# EAGLE design Explorer (EAGLE 9.6.2)
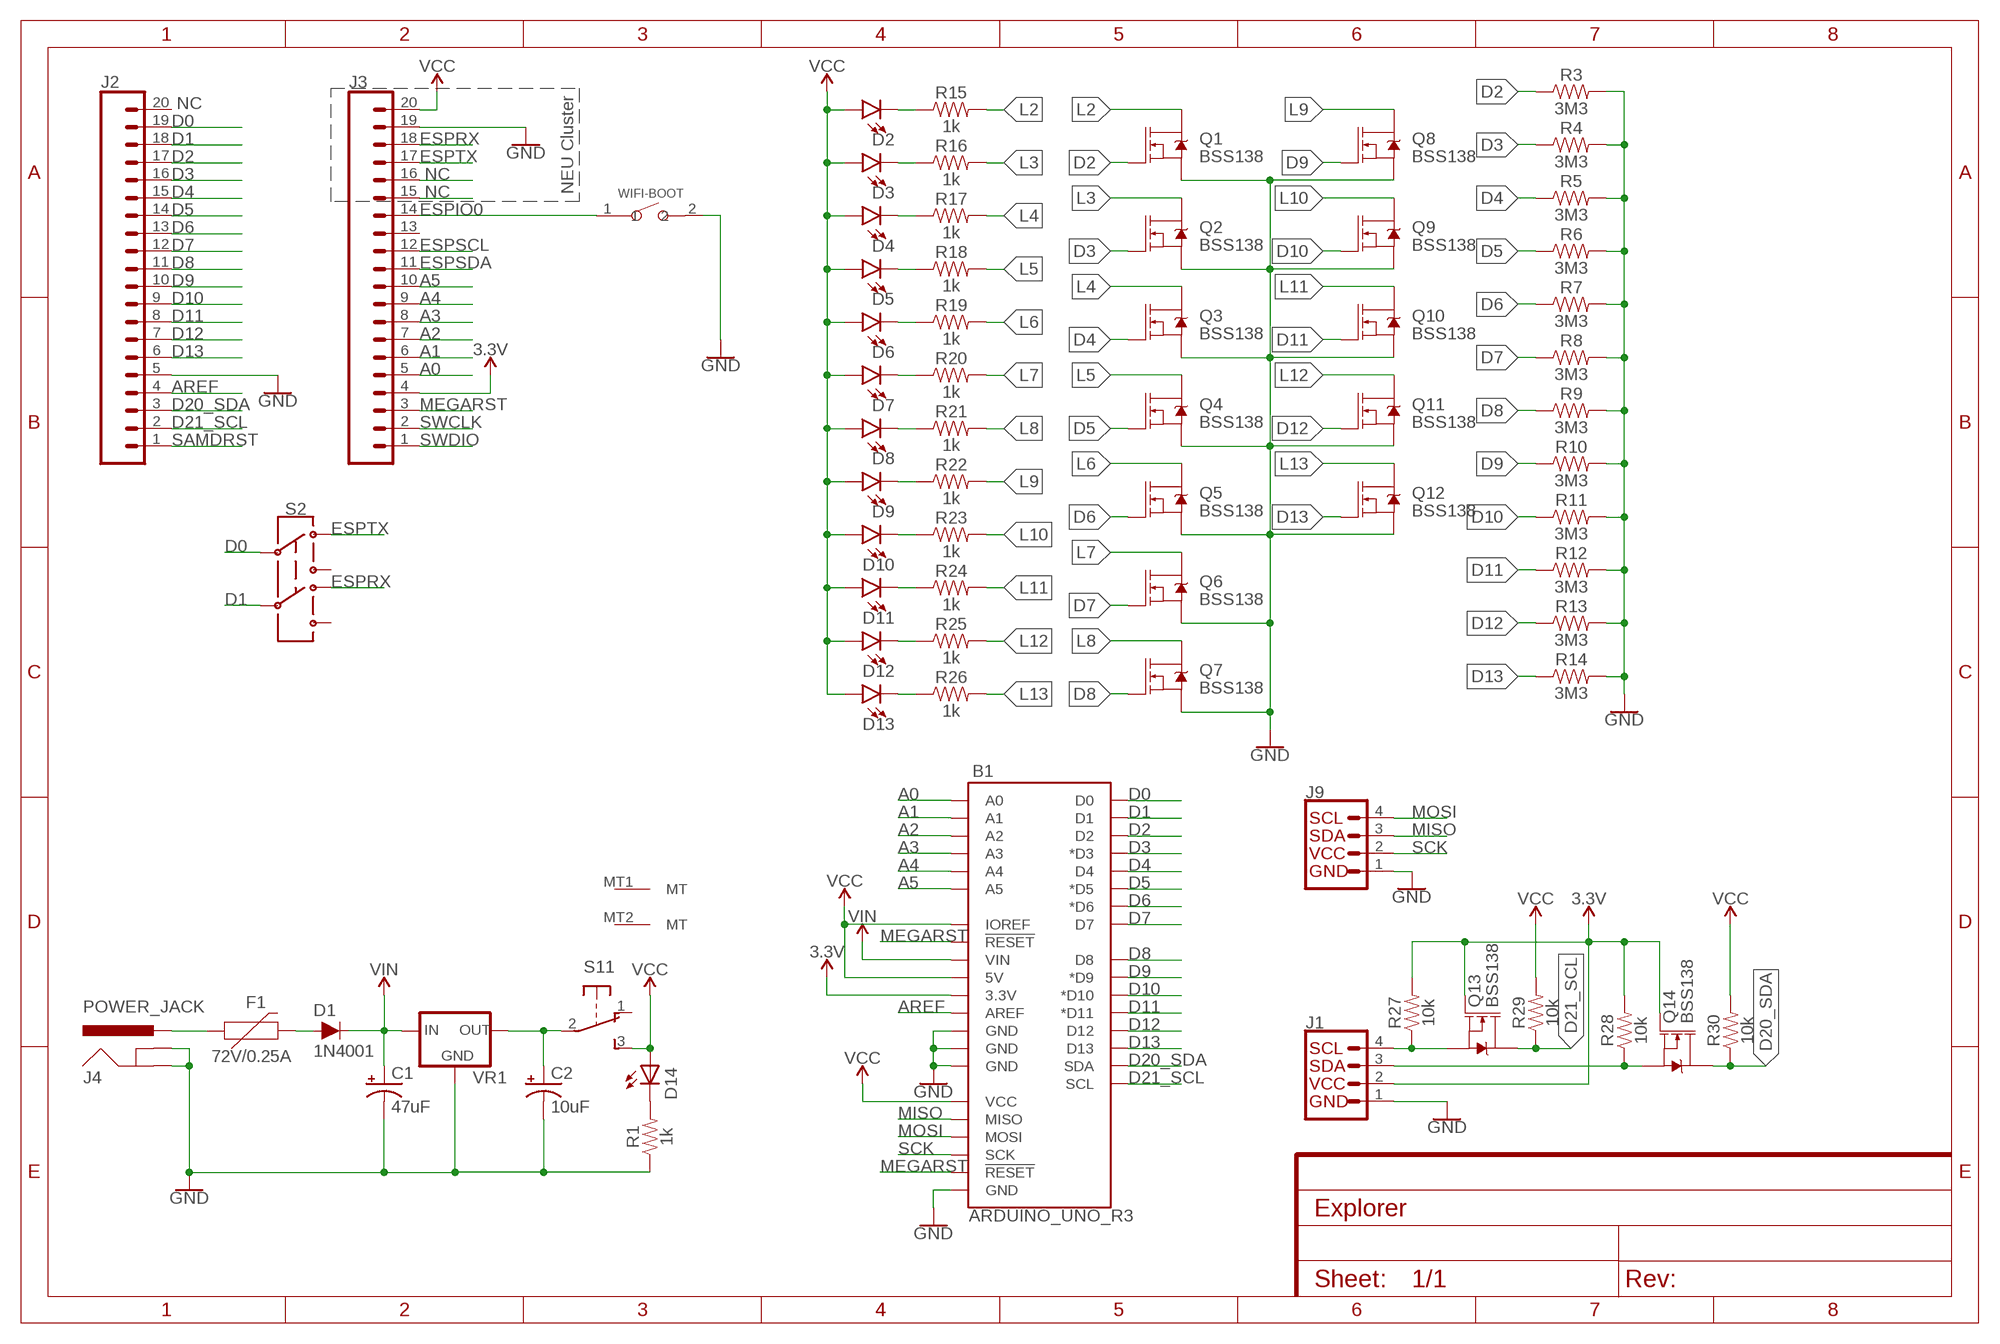
[diagram p0: schematic, sheet 1]

## Parts
B1  ARDUINO_UNO_R3  [ARDUINO_R3]
C1  47uF  100UF-POLAR-RADIAL-2.5MM-25V-20%  [CPOL-RADIAL-2.5MM-6.5MM]
C2  10uF  100UF-POLAR-RADIAL-2.5MM-25V-20%  [CPOL-RADIAL-2.5MM-6.5MM]
D1  1N4001  DIODE-KIT2  [DIODE-1N4001-KIT]
D2  LED0603  [LED-0603]
D3  LED0603  [LED-0603]
D4  LED0603  [LED-0603]
D5  LED0603  [LED-0603]
D6  LED0603  [LED-0603]
D7  LED0603  [LED-0603]
D8  LED0603  [LED-0603]
D9  LED0603  [LED-0603]
D10  LED0603  [LED-0603]
D11  LED0603  [LED-0603]
D12  LED0603  [LED-0603]
D13  LED0603  [LED-0603]
D14  LEDCHIPLED_0805  [CHIPLED_0805]
F1  72V/0.25A  PPTC_PTH  [PTH]
J1  QWIIC_CONNECTORJS-1MM  [1X04_1MM_RA]
J2  CONN_20  [1X20]
J3  CONN_20  [1X20]
J4  POWER_JACK  [POWER_JACK_PTH]
J9  QWIIC_CONNECTORJS-1MM  [1X04_1MM_RA]
Q1  BSS138  MOSFET-NCH-BSS138  [SOT23-3]
Q2  BSS138  MOSFET-NCH-BSS138  [SOT23-3]
Q3  BSS138  MOSFET-NCH-BSS138  [SOT23-3]
Q4  BSS138  MOSFET-NCH-BSS138  [SOT23-3]
Q5  BSS138  MOSFET-NCH-BSS138  [SOT23-3]
Q6  BSS138  MOSFET-NCH-BSS138  [SOT23-3]
Q7  BSS138  MOSFET-NCH-BSS138  [SOT23-3]
Q8  BSS138  MOSFET-NCH-BSS138  [SOT23-3]
Q9  BSS138  MOSFET-NCH-BSS138  [SOT23-3]
Q10  BSS138  MOSFET-NCH-BSS138  [SOT23-3]
Q11  BSS138  MOSFET-NCH-BSS138  [SOT23-3]
Q12  BSS138  MOSFET-NCH-BSS138  [SOT23-3]
Q13  BSS138  MOSFET-NCH-BSS138  [SOT23-3]
Q14  BSS138  MOSFET-NCH-BSS138  [SOT23-3]
R1  1k  RESISTOR0603  [0603]
R3  3M3  RESISTOR0603  [0603]
R4  3M3  RESISTOR0603  [0603]
R5  3M3  RESISTOR0603  [0603]
R6  3M3  RESISTOR0603  [0603]
R7  3M3  RESISTOR0603  [0603]
R8  3M3  RESISTOR0603  [0603]
R9  3M3  RESISTOR0603  [0603]
R10  3M3  RESISTOR0603  [0603]
R11  3M3  RESISTOR0603  [0603]
R12  3M3  RESISTOR0603  [0603]
R13  3M3  RESISTOR0603  [0603]
R14  3M3  RESISTOR0603  [0603]
R15  1k  10KOHM-0603-1/10W-1%  [0603]
R16  1k  10KOHM-0603-1/10W-1%  [0603]
R17  1k  10KOHM-0603-1/10W-1%  [0603]
R18  1k  10KOHM-0603-1/10W-1%  [0603]
R19  1k  10KOHM-0603-1/10W-1%  [0603]
R20  1k  10KOHM-0603-1/10W-1%  [0603]
R21  1k  10KOHM-0603-1/10W-1%  [0603]
R22  1k  10KOHM-0603-1/10W-1%  [0603]
R23  1k  10KOHM-0603-1/10W-1%  [0603]
R24  1k  10KOHM-0603-1/10W-1%  [0603]
R25  1k  10KOHM-0603-1/10W-1%  [0603]
R26  1k  10KOHM-0603-1/10W-1%  [0603]
R27  10k  10KOHM-0603-1/10W-1%  [0603]
R28  10k  10KOHM-0603-1/10W-1%  [0603]
R29  10k  10KOHM-0603-1/10W-1%  [0603]
R30  10k  10KOHM-0603-1/10W-1%  [0603]
S1  EG1213  [EG1213]
S2  SWITCH-DPDT-SMD-AYZ0202  [SWITCH_DPDT_SMD_AYZ0202]
VR1  V_REG_78XXSINK  [TO220-IGO]
WIFI-BOOT  SKRKAEE020  SMD-BUTTON(2P-3.9X2.9X1.5+0.4MM)-SKRKAEE020  [SW2-2.6-3.9X2.9X1.5+0.4MM]

## Nets
3.3V: B1.3.3V J1.2(VCC) J3.4 Q13.1(G) Q14.1(G) R27.2 R28.2
A0: B1.A0 J3.5
A1: B1.A1 J3.6
A2: B1.A2 J3.7
A3: B1.A3 J3.8
A4: B1.A4 J3.9
A5: B1.A5 J3.10
AREF: B1.AREF J2.4
D0: B1.D0 J2.19 S2.2
D1: B1.D1 J2.18 S2.5
D2: B1.D2 J2.17 Q1.1(G) R3.1
D3: B1.D3(*D3) J2.16 Q2.1(G) R4.1
D4: B1.D4 J2.15 Q3.1(G) R5.1
D5: B1.D5(*D5) J2.14 Q4.1(G) R6.1
D6: B1.D6(*D6) J2.13 Q5.1(G) R7.1
D7: B1.D7 J2.12 Q6.1(G) R8.1
D8: B1.D8 J2.11 Q7.1(G) R9.1
D9: B1.D9(*D9) J2.10 Q8.1(G) R10.1
D10: B1.D10(*D10) J2.9 Q9.1(G) R11.1
D11: B1.D11(*D11) J2.8 Q10.1(G) R12.1
D12: B1.D12 J2.7 Q11.1(G) R13.1
D13: B1.D13 J2.6 Q12.1(G) R14.1
D20_SDA: B1.SDA J2.3 Q14.3(D) R30.1
D21_SCL: B1.SCL J2.2 Q13.3(D) R29.1
ESPIO0: J3.14 WIFI-BOOT.1
ESPRX: J3.18 S2.4
ESPSCL: J3.12
ESPSDA: J3.11
ESPTX: J3.17 S2.1
GND: B1.GND@1(GND) B1.GND@2(GND) B1.GND@3(GND) B1.GND@4(GND) C1.2(-) C2.2(-) J1.1(GND) J2.5 J3.19 J4.GND J4.GNDBREAK J9.1(GND) Q1.2(S) Q2.2(S) Q3.2(S) Q4.2(S) Q5.2(S) Q6.2(S) Q7.2(S) Q8.2(S) Q9.2(S) Q10.2(S) Q11.2(S) Q12.2(S) R1.1 R3.2 R4.2 R5.2 R6.2 R7.2 R8.2 R9.2 R10.2 R11.2 R12.2 R13.2 R14.2 VR1.GND WIFI-BOOT.2
L2: Q1.3(D) R15.2
L3: Q2.3(D) R16.2
L4: Q3.3(D) R17.2
L5: Q4.3(D) R18.2
L6: Q5.3(D) R19.2
L7: Q6.3(D) R20.2
L8: Q7.3(D) R21.2
L9: Q8.3(D) R22.2
L10: Q9.3(D) R23.2
L11: Q10.3(D) R24.2
L12: Q11.3(D) R25.2
L13: Q12.3(D) R26.2
MEGARST: B1.RESET@1(!RESET!) B1.RESET@2(!RESET!) J3.3
MISO: B1.MISO J9.3(SDA)
MOSI: B1.MOSI J9.4(SCL)
N$1: F1.P$1 J4.PWR
N$2: D1.A F1.P$2
N$3: J3.16
N$5: J3.15
N$6: D14.C R1.2
N$7: C2.1(+) S1.2(1:P) VR1.OUT
N$10: D13.C R26.1
N$11: D12.C R25.1
N$12: D11.C R24.1
N$13: D10.C R23.1
N$14: D9.C R22.1
N$15: D8.C R21.1
N$16: D7.C R20.1
N$17: D6.C R19.1
N$18: D5.C R18.1
N$19: D4.C R17.1
N$20: D3.C R16.1
N$21: D2.C R15.1
SAMDRST: J2.1
SCK: B1.SCK J9.2(VCC)
SCL_3V: J1.4(SCL) Q13.2(S) R27.1
SDA_3V: J1.3(SDA) Q14.2(S) R28.1
SWCLK: J3.2
SWDIO: J3.1
VCC: B1.5V B1.IOREF B1.VCC D2.A D3.A D4.A D5.A D6.A D7.A D8.A D9.A D10.A D11.A D12.A D13.A D14.A J3.20 R29.2 R30.2 S1.3(1:S)
VIN: B1.VIN C1.1(+) D1.C VR1.IN
Unconnected: J2.20 J3.13 S1.1(1:O) S1.MT1(MT) S1.MT2(MT) S2.3 S2.6

## Notes on the sheet
- NC
- NEU Cluster
- NC
- NC

## Library data of the parts
B1 = SparkFun-Boards:ARDUINO_UNO_R3: Arduino R3 Footprint with SPI header Arduino Uno R3 Compatible Footprint. Matches PCB size of the original board. SparkFun Products: SAMD21 Dev Breakout <https://www.sparkfun.com/products/13672> RedBoard <https://www.sparkfun.com/products/12757> R3 Stackable Headers <https://www.sparkfun.com/products/11417>
C1 = SparkFun-Capacitors:100UF-POLAR: 100µF polarized capacitors A capacitor is a passive two-terminal electrical component used to store electrical energy temporarily in an electric field.; E14PID: 9452494; PROD_ID: CAP-08439; VALUE: 100uF
C2 = SparkFun-Capacitors:100UF-POLAR: 100µF polarized capacitors A capacitor is a passive two-terminal electrical component used to store electrical energy temporarily in an electric field.; E14PID: 1870986; PROD_ID: CAP-08439; VALUE: 100uF
D1 = SparkFun-DiscreteSemi:DIODE: Diode These are standard reverse protection diodes and small signal diodes. SparkFun Products: SparkFun SparkPunk Sound Kit <https://www.sparkfun.com/products/11177> SparkFun ESP8266 Thing <https://www.sparkfun.com/products/13231>; PROD_ID: DIO-09176; VALUE: 1A/50V/1.1V
D2-D13 = SparkFun-LED:LED: LED (Generic) Standard schematic elements and footprints for 5mm, 3mm, 1206, and 0603 sized LEDs. Generic LEDs with no color specified.; LCSC_PART: C2286
D14 = adafruit:LED: LED OSRAM: - CHIPLED LG R971, LG N971, LY N971, LG Q971, LY Q971, LO R971, LY R971 LH N974, LH R974 LS Q976, LO Q976, LY Q976 LO Q996 - Hyper CHIPLED LW Q18S LB Q993, LB Q99A, LB R99A - SideLED LS A670, LO A670, LY A670, LG A670, LP A670 LB A673, LV A673, LT A673, LW A673 LH A674 LY A675 LS A676, LA A676, LO A676, LY A676, LW A676 LS A679, LY A679, LG A679 - Hyper Micro SIDELED® LS Y876, LA Y876, LO Y876, LY Y876 LT Y87S - SmartLED LW L88C, LW L88S LB L89C, LB L89S, LG L890 LS L89K, LO L89K, LY L89K LS L896, LA L896, LO L896, LY L896 - TOPLED LS T670, LO T670, LY T670, LG T670, LP T670 LSG T670, LSP T670, LSY T670, LOP T670, LYG T670 LG T671, LOG T671, LSG T671 LB T673, LV T673, LT T673, LW T673 LH T674 LS T676, LA T676, LO T676, LY T676, LB T676, LH T676, LSB T676, LW T676 LB T67C, LV T67C, LT T67C, LS T67K, LO T67K, LY T67K, LW E67C LS E67B, LA E67B, LO E67B, LY E67B, LB E67C, LV E67C, LT E67C LW T67C LS T679, LY T679, LG T679 LS T770, LO T770, LY T770, LG T770, LP T770 LB T773, LV T773, LT T773, LW T773 LH T774 LS E675, LA E675, LY E675, LS T675 LS T776, LA T776, LO T776, LY T776, LB T776 LHGB T686 LT T68C, LB T68C - Hyper Mini TOPLED® LB M676 - Mini TOPLED Santana® LG M470 LS M47K, LO M47K, LY M47K Source: http://www.osram.convergy.de/; LCSC_PART: C2296
F1 = SparkFun-Fuses:PPTC: Resettable Fuse PPTC Resettable Fuse. Really a sort of resistor with a polymeric positive temperature coefficient whose resistance increases dramatically with an increase in temperature. When heated by the power passing through the resistance rises causing the current to be limited, protecting the circuit. This is achieved by the transition of the polymer from a crystalline to an amorphous state where the conductive carbon separates breaking the conductive pathways found in the cool crystalline structure. When a PPTC cools back down it resumes conducting letting the circuit turn back on. SparkFun Products: SparkFun RedBoard - Programmed with Arduino <https://www.sparkfun.com/products/12757> Pro Micro - 5V/16MHz <https://www.sparkfun.com/products/12640> Arduino Pro 328 - 5V/16MHz <https://www.sparkfun.com/products/10915> MP3 Trigger <https://www.sparkfun.com/products/13720>; PROD_ID: RES-08490
J1 = SparkFun-Connectors:QWIIC_CONNECTOR: SparkFun I2C Standard Qwiic Connector An SMD 1mm pitch JST connector makes it easy and quick (get it? Qwiic?) to connect I2C devices to each other. The Qwiic system <http://www.sparkfun.com/qwiic> enables fast and solderless connection between popular platforms and various sensors and actuators. We carry 200mm <https://www.sparkfun.com/products/14204>, 100mm <https://www.sparkfun.com/products/14205>, 50mm <https://www.sparkfun.com/products/14206>, and breadboard friendly <https://www.sparkfun.com/products/14207> Qwiic cables. We also offer 10 pcs strips <https://www.sparkfun.com/products/14323> the SMD connectors.; LCSC_PART: C239522; LCSC_PART_OLD: C145956
J2 J3 = SparkFun-Connectors:CONN_20: Multi connection point. Often used as Generic Header-pin footprint for 0.1 inch spaced/style header connections On any of the 0.1 inch spaced packages, you can populate with these: Break Away Headers - Straight <https://www.sparkfun.com/products/116> (PRT-00116) Break Away Male Headers - Right Angle <https://www.sparkfun.com/products/553> (PRT-00553) Female Headers <https://www.sparkfun.com/products/115> (PRT-00115) Break Away Headers - Machine Pin <https://www.sparkfun.com/products/117> (PRT-00117) Break Away Female Headers - Swiss Machine Pin <https://www.sparkfun.com/products/743> (PRT-00743) For SCREWTERMINALS and SPRING TERMINALS visit here: Screw Terimnals on SparkFun.com <https://www.sparkfun.com/search/results?term=Screw+Terminals> (5mm/3.5mm/2.54mm spacing) This device is also useful as a general connection point to wire up your design to another part of your project. Our various solder wires solder well into these plated through hole pads. Hook-Up Wire - Assortment (Stranded, 22 AWG) <https://www.sparkfun.com/products/11375> (PRT-11375) Hook-Up Wire - Assortment (Solid Core, 22 AWG) <https://www.sparkfun.com/products/11367> (PRT-11367) View the entire wire category on our website here <https://www.sparkfun.com/categories/141> Special notes: Molex polarized connector foot print use with SKU : PRT-08231 with associated crimp pins and housings. 1MM SMD Version SKU: PRT-10208 NOTES ON THE VARIANTS LOCK and LOCK_LONGPADS... This footprint was designed to help hold the alignment of a through-hole component (i.e. 6-pin header) while soldering it into place. You may notice that each hole has been shifted either up or down by 0.005 of an inch from it's more standard position (which is a perfectly straight line). This slight alteration caused the pins (the squares in the middle) to touch the edges of the holes. Because they are alternating, it causes a "brace" to hold the component in place. 0.005 has proven to be the perfect amount of "off-center" position when using our standard breakaway headers. Although looks a little odd when you look at the bare footprint, once you have a header in there, the alteration is very hard to notice. Also,if you push a header all the way into place, it is covered up entirely on the bottom side. Note about LOCK SPECIAL package: This is just like the LOCK variant in that the holes are staggared by 5 mil, but except for the last two holes. They are not altered from the "standard" footprint layout. This is used for a special purpose on the layout of our Graphic LCD Backpack. Make sure you want to use this device before selecting it for you project!; LCSC_PART: C50984
J4 = SparkFun-Connectors:POWER_JACK: Power Jack Connector This is the standard 5.5mm barrel jack for power. The PTH is the most common, proven, reliable, footprint. The Slot footprint only works if the mill layer is transmitted to the PCB fab house so be warned. Here are the connectors we sell at SparkFun: DC Barrel Power Jack/Connector <https://www.sparkfun.com/products/119> (PRT-00119) DC Barrel Power Jack/Connector (SMD) <https://www.sparkfun.com/products/12748> (PRT-12748) DC Barrel Jack Adapter - Breadboard Compatible <https://www.sparkfun.com/products/10811> (PRT-10811) It is used on this SparkFun product (and many, many others): SparkFun RedBoard - Programmed with Arduino <https://www.sparkfun.com/products/12757> (DEV-12757) Also, if you need a mating power supply or connector, please check these out: Wall Adapter Power Supply - 9VDC 650mA <https://www.sparkfun.com/products/298> (TOL-00298) DC Barrel Jack Adapter - Male <https://www.sparkfun.com/products/10287> (PRT-10287); PROD_ID: CONN-08197
J9 = SparkFun-Connectors:QWIIC_CONNECTOR: SparkFun I2C Standard Qwiic Connector An SMD 1mm pitch JST connector makes it easy and quick (get it? Qwiic?) to connect I2C devices to each other. The Qwiic system <http://www.sparkfun.com/qwiic> enables fast and solderless connection between popular platforms and various sensors and actuators. We carry 200mm <https://www.sparkfun.com/products/14204>, 100mm <https://www.sparkfun.com/products/14205>, 50mm <https://www.sparkfun.com/products/14206>, and breadboard friendly <https://www.sparkfun.com/products/14207> Qwiic cables. We also offer 10 pcs strips <https://www.sparkfun.com/products/14323> the SMD connectors.; LCSC_PART: C239522
Q1-Q14 = SparkFun-DiscreteSemi:MOSFET-NCH: N-channel MOSFETs Voltage controlled devices that allow control of high current outputs. SparkFun Products: SparkFun OpenScale <https://www.sparkfun.com/products/13261> SparkFun Digital Sandbox <https://www.sparkfun.com/products/12651> SparkFun Monster Moto Shield <https://www.sparkfun.com/products/10182> SparkFun MOSFET Power Controller <https://www.sparkfun.com/products/11214>; LCSC_PART: C435876; PROD_ID: TRANS-00830; VALUE: 220mA/50V/3.5Ω
R1 = SparkFun-Resistors:RESISTOR: Generic Resistor Package; LCSC_PART: C21190
R3-R14 = SparkFun-Resistors:RESISTOR: Generic Resistor Package; LCSC_PART: C103556
R15-R26 = SparkFun-Resistors:10KOHM: 10kΩ resistor A resistor is a passive two-terminal electrical component that implements electrical resistance as a circuit element. Resistors act to reduce current flow, and, at the same time, act to lower voltage levels within circuits. - Wikipedia; LCSC_PART: C21190; PROD_ID: RES-00824; VALUE: 10k
R27-R30 = SparkFun-Resistors:10KOHM: 10kΩ resistor A resistor is a passive two-terminal electrical component that implements electrical resistance as a circuit element. Resistors act to reduce current flow, and, at the same time, act to lower voltage levels within circuits. - Wikipedia; LCSC_PART: C25804; PROD_ID: RES-00824
S1 = adafruit:EG1213: E-Switch right-angle slide SPDT Part #EG1213 http://www.ladyada.net/library/eagle
S2 = SparkFun-Switches:SWITCH-DPDT: Double-Pole, Double-Throw (DPDT) Switch Double-pole, double-throw switches. Variant Overview PTH-GPI-152-3013 Used on SparkFun Geiger Counter <https://www.sparkfun.com/products/11345> SMD-AY0202 Surface Mount DPDT Switch <https://www.sparkfun.com/products/597> (COM-00597) Used on e.g. LilyPad Arduino USB - ATmega32U4 Board <https://www.sparkfun.com/products/12049>; LCSC_PART: C318999; PROD_ID: SWCH-08179; SF_SKU: COM-00597
VR1 = SparkFun-IC-Power:V_REG_78XX: Voltage Regulator Standard 78xx regulator. IGO (Input Ground Output). Spark Fun Electronics SKU : COM-00107
WIFI-BOOT = D3ltav's Custom:SMD-BUTTON(2P-3.9X2.9X1.5+0.4MM): 311020047; LCSC_PART: C455280; MPN: SKRKAEE020

## Board
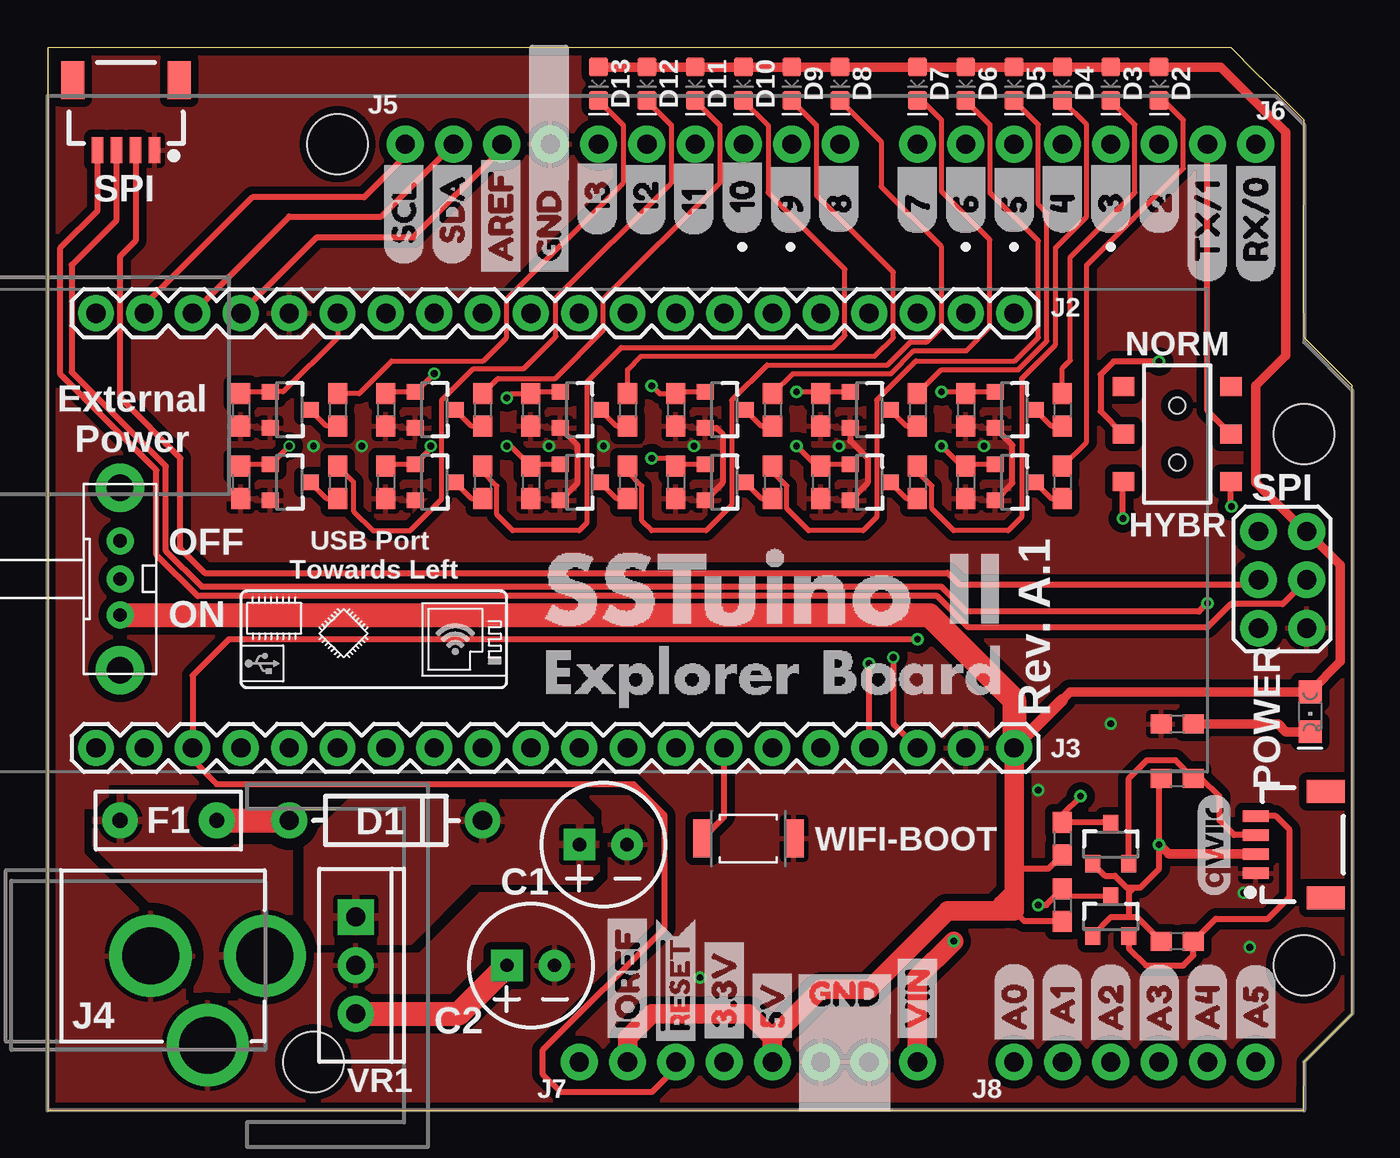
[diagram p1: board, top side]
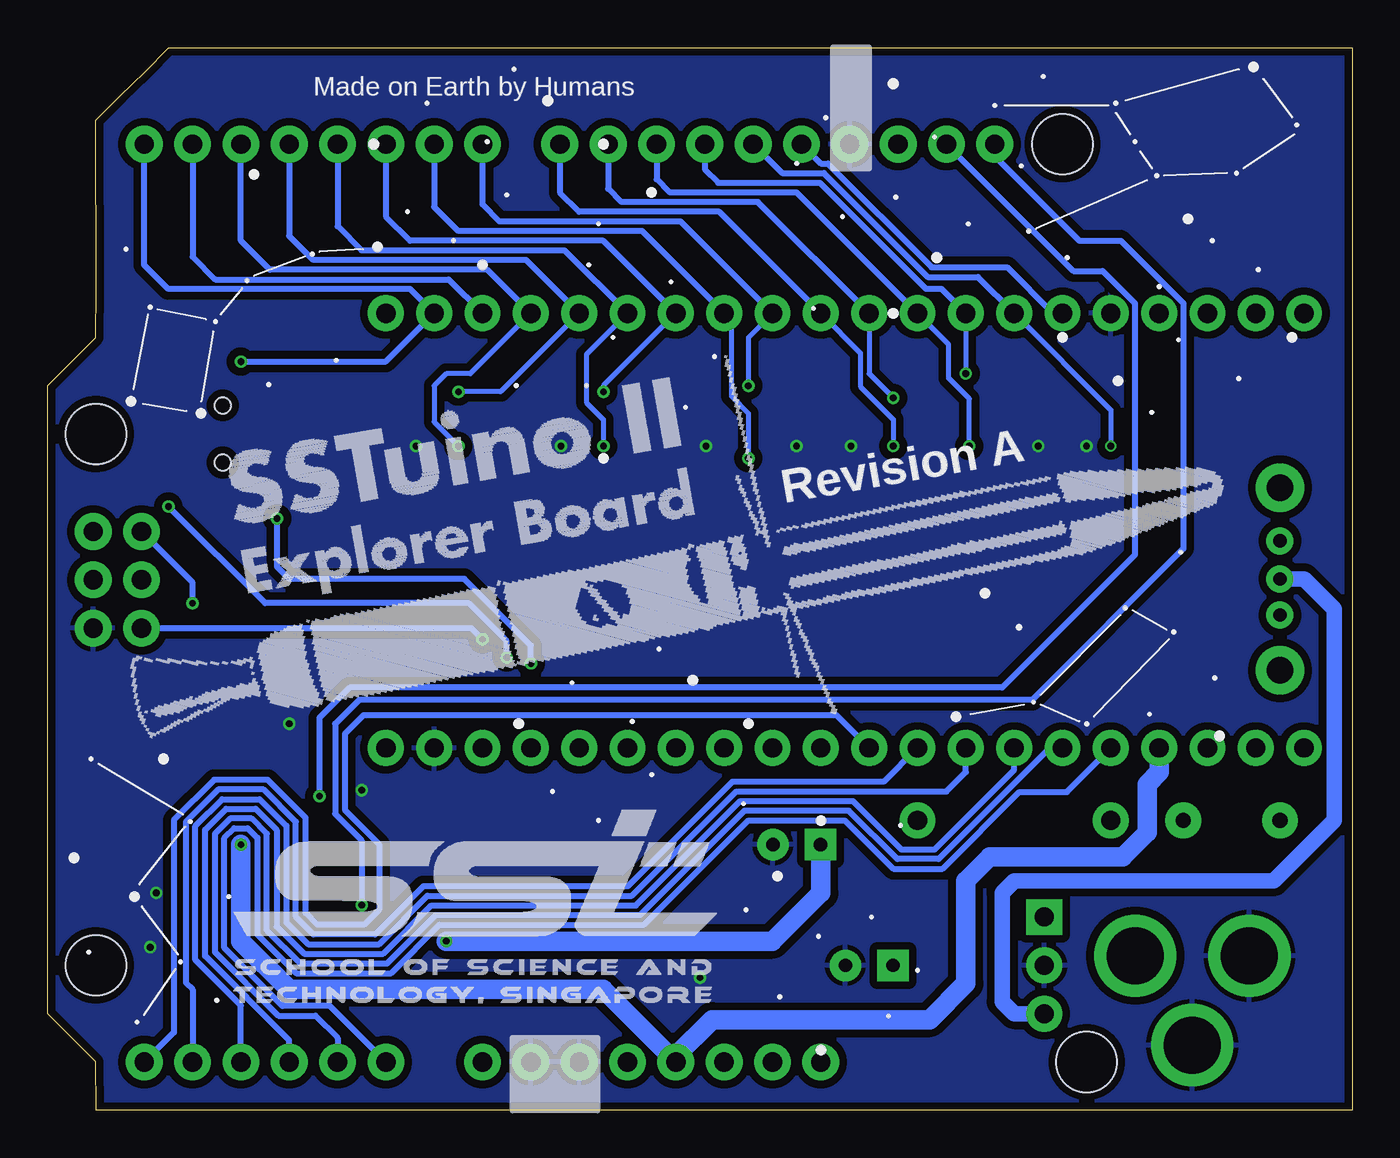
[diagram p2: board, bottom side, seen from below]

Size 68.58 x 55.88 mm. Coordinates in mm from the lower left corner, seen from the top.
Outline: 0,0 66.02,0 66.02,0.02 66.04,2.54 68.58,5.08 68.58,38.1 66.04,40.64 66.02,43.16 66.04,52.07 64.77,53.34 63.48,54.59 62.21,55.88 0,55.88 0,0
Copper layers (1*16): Top 0.035mm / dielectric 1.6mm / Bottom 0.035mm
Design rules "jlcpcb-2layers-loose-drillcorrect": minimum track width 5mil, minimum drill 0.3mm, track to track 5mil, track to pad 5mil, pad to pad 5mil, via to via 5mil, smd to smd 5mil, copper to edge 0.2mm, drill to drill 6mil, minimum pad ring 10mil, minimum via ring 3mil, stop-mask expansion 4mil, vias tented up to drill 0mil, thermal gap 10mil

### Footprints (pad centres in the part's own frame; a part is rotated, then mirrored left to right if it is on the bottom)
ARDUINO_R3 = drill 1.016 pad 1.93: 3.3V 2.54,-24.13; 5V 5.08,-24.13; A0 17.78,-24.13; A1 20.32,-24.13; A2 22.86,-24.13; A3 25.4,-24.13; A4 27.94,-24.13; A5 30.48,-24.13; AREF -9.144,24.13; D0 30.48,24.13; D1 27.94,24.13; D2 25.4,24.13; D3 22.86,24.13; D4 20.32,24.13; D5 17.78,24.13; D6 15.24,24.13; D7 12.7,24.13; D8 8.636,24.13; D9 6.096,24.13; D10 3.556,24.13; D11 1.016,24.13; D12 -1.524,24.13; D13 -4.064,24.13; GND@1 7.62,-24.13; GND@2 10.16,-24.13; GND@3 -6.604,24.13; GND@4 33.16,-1.32; IOREF -2.54,-24.13; MISO 30.62,3.76; MOSI 33.16,1.22; NC -5.08,-24.13; RESET@1 0,-24.13; RESET@2 30.62,-1.32; SCK 30.62,1.22; SCL -14.224,24.13; SDA -11.684,24.13; VCC 33.16,3.76; VIN 12.7,-24.13 | hole 3.175: -17.78,24.13; 33.02,8.89; 33.02,-19.05; -19.05,-24.13
CPOL-RADIAL-2.5MM-6.5MM = drill 0.7 pad 1.651 square: 1 1.25,0 | drill 0.7 pad 1.651: 2 -1.25,0
DIODE-1N4001-KIT = drill 1.016 pad 1.88: A -5.08,0; C 5.08,0
LED-0603 = smd 1 x 1: A -0.877,0; C 0.877,0
CHIPLED_0805 = smd 1.2 x 1.2: A 0,-1.05; C 0,1.05
PTH = drill 0.8 pad 1.88: P$1 -2.54,0; P$2 2.54,0
1X04_1MM_RA = smd 0.6 x 1.35: 1 -1.5,0; 2 -0.5,0; 3 0.5,0; 4 1.5,0 | smd 1.2 x 2: NC1 2.8,-3.675; NC2 -2.8,-3.675
1X20 = drill 1.016 pad 1.88: 1 0,0; 2 2.54,0; 3 5.08,0; 4 7.62,0; 5 10.16,0; 6 12.7,0; 7 15.24,0; 8 17.78,0; 9 20.32,0; 10 22.86,0; 11 25.4,0; 12 27.94,0; 13 30.48,0; 14 33.02,0; 15 35.56,0; 16 38.1,0; 17 40.64,0; 18 43.18,0; 19 45.72,0; 20 48.26,0
POWER_JACK_PTH = drill 2.997 pad 4.318: GND 0,7.7; GNDBREAK 4.7,10.7; PWR 0,13.7
SOT23-3 = smd 0.8 x 0.9: 1 -0.95,-1; 2 0.95,-1; 3 0,1.1
0603 = smd 1.1 x 1: 1 -0.85,0; 2 0.85,0
EG1213 = drill 0.7 pad 1.422: 1 -2,0; 2 0,0; 3 1.9,0 | drill 1.4 pad 2.54: MT1 -4.8,0; MT2 4.8,0
SWITCH_DPDT_SMD_AYZ0202 = smd 1 x 1.15: 1 -2.5,2.825; 2 0,2.825; 3 2.5,2.825; 4 -2.5,-2.825; 5 0,-2.825; 6 2.5,-2.825 | hole 0.85: 1.5,0; -1.5,0
TO220-IGO = drill 1 pad 1.88: GND 0,0; OUT 2.54,0 | drill 1 pad 1.88 square: IN -2.54,0
SW2-2.6-3.9X2.9X1.5+0.4MM = smd 1 x 2: 1 -2.4,0; 2 2.4,0

### Placement (x,y rotation side)
B1  33.02,26.67 0 top
C1  29.21,13.97 180 top
C2  25.4,7.62 180 top
D1  17.78,15.24 0 top
D2  58.42,53.98 270 top
D3  55.88,53.98 270 top
D4  53.34,53.98 270 top
D5  50.8,53.98 270 top
D6  48.26,53.98 270 top
D7  45.72,53.98 270 top
D8  41.66,53.98 270 top
D9  39.12,53.98 270 top
D10  36.58,53.98 270 top
D11  34.04,53.98 270 top
D12  31.5,53.98 270 top
D13  28.96,53.98 270 top
D14  66.36,20.95 180 top
F1  6.35,15.24 0 top
J1  63.5,13.97 90 top
J2  2.54,41.91 0 top
J3  2.54,19.05 0 top
J4  -2.29,8.13 270 top
J9  4.13,50.48 180 top
Q1  50.8,33.02 270 top
Q2  50.8,36.83 270 top
Q3  43.18,33.02 270 top
Q4  43.18,36.83 270 top
Q5  35.56,33.02 270 top
Q6  35.56,36.83 270 top
Q7  27.94,33.02 270 top
Q8  27.94,36.83 270 top
Q9  20.32,33.02 270 top
Q10  20.32,36.83 270 top
Q11  12.7,33.02 270 top
Q12  12.7,36.83 270 top
Q13  55.88,10.16 0 top
Q14  55.88,13.97 0 top
R1  59.37,20.32 0 top
R3  48.26,33.02 270 top
R4  48.26,36.83 270 top
R5  40.64,33.02 270 top
R6  40.64,36.83 270 top
R7  33.02,33.02 270 top
R8  33.02,36.83 270 top
R9  25.4,33.02 270 top
R10  25.4,36.83 270 top
R11  17.78,33.02 270 top
R12  17.78,36.83 270 top
R13  10.16,33.02 270 top
R14  10.16,36.83 270 top
R15  53.34,33.02 270 top
R16  53.34,36.83 270 top
R17  45.72,33.02 270 top
R18  45.72,36.83 270 top
R19  38.1,33.02 270 top
R20  38.1,36.83 270 top
R21  30.48,33.02 270 top
R22  30.48,36.83 270 top
R23  22.86,33.02 270 top
R24  22.86,36.83 270 top
R25  15.24,33.02 270 top
R26  15.24,36.83 270 top
R27  59.37,8.89 180 top
R28  59.37,17.46 180 top
R29  53.34,10.79 270 top
R30  53.34,14.29 270 top
S1  3.81,27.94 270 top
S2  59.37,35.56 90 top
U$1  [IOREF9]  30.48,3.17 90 top
U$2  [3#3V7]  35.56,3.17 90 top
U$3  [#RESET28]  33.02,2.86 90 top
U$4  [5V8]  38.1,3.17 90 top
U$5  [GND6]  38.87,6.12 0 top
U$6  [A00]  50.8,3.07 90 top
U$7  [A11]  53.34,3.4 90 top
U$8  [SST-BIG]  59.69,5.08 0 bottom
U$9  [EXPLORER]  36.83,27.94 345 bottom
U$10  [STARFIELD_URSAMINOR]  64.45,49.21 270 bottom
U$11  [STARFIELD_SMALL]  33.02,49.53 180 bottom
U$12  [STARFIELD_ORION]  19.05,55.88 270 bottom
U$13  [STARFIELD_LYRA]  6.99,19.68 90 bottom
U$14  [STARFIELD_CASSIOPEIA]  59.05,4.13 90 bottom
U$15  [STARFIELD_SMALL2]  22.86,2.54 90 bottom
U$16  [STARFIELD_SMALL2]  44.45,15.24 0 bottom
U$17  [STARFIELD_SMALL2]  29.21,54.61 270 bottom
U$18  [STARFIELD_SMALL2]  2.54,45.72 180 bottom
U$19  [STARFIELD_SMALL2]  52.07,45.72 0 bottom
U$20  [A22]  55.88,2.86 90 top
U$21  [EXPLORER_BOARD_LARGE]  46.99,33.02 10 bottom
U$22  [A33]  58.42,3.04 90 top
U$23  [A44]  60.96,2.86 90 top
U$24  [A55]  63.5,3.17 90 top
U$25  [GND6]  26.35,43.5 90 top
U$26  [1314]  28.89,45.97 90 top
U$27  [1215]  31.43,45.72 90 top
U$28  [1116]  33.97,45.72 90 top
U$29  [1017]  36.51,46.04 90 top
U$30  [9__18]  39.05,46.04 90 top
U$31  [8__19]  41.59,46.04 90 top
U$32  [7__20]  45.72,46.04 90 top
U$33  [6__21]  48.26,46.04 90 top
U$34  [5__22]  50.8,46.04 90 top
U$35  [4__23]  53.34,46.04 90 top
U$36  [3__24]  55.88,46.04 90 top
U$37  [2__25]  58.42,46.04 90 top
U$38  [TX#127]  60.96,43.5 90 top
U$39  [RX#026]  63.5,43.5 90 top
U$40  [AREF13]  23.81,43.5 90 top
U$41  [SDA25]  21.27,44.45 90 top
U$42  [SCL26]  18.73,44.45 90 top
U$43  [VIN10]  45.72,3.17 90 top
U$44  [QWIIC_LOGO]  61.28,13.97 90 top
U$45  [EXPLORER_BOARD_LARGE]  38.1,25.72 0 top
U$46  [USBLOGO#PNG]  11.27,23.49 0 top
U$47  [WIFILOGO#JPG]  21.43,24.77 0 top
VR1  16.19,7.62 270 top
WIFI-BOOT  36.83,14.29 0 top

### Tracks (layer width: path | path; a pad name or v marks a point on that pad's centre or on a via)
3.3V  (via drill 0.35 pad 0.65)
  Top 0.305: Q13.1 54.93,9.21 55.88,10.16 56.83,10.16 | 56.83,10.16 57.25,10.16 R27.2 | 56.83,11.72 56.83,11.43 | 56.83,11.43 56.83,10.16 | R28.2 58.42,17.36 v58.42,13.97 58.42,12.7 57.44,11.72 57.12,11.72 | 56.83,11.72 57.12,11.72 | 56.83,11.43 57.12,11.72 | Q14.1 55.57,12.33 56.09,12.33 56.7,11.72 56.83,11.72
  Top 0.508: J1.2 58.92,13.47 v58.42,13.97
  Bottom 1.016: J3.4 10.16,17.78 10.79,17.14 10.79,14.61 12.06,13.34 19.05,13.34 20.32,12.06 20.32,6.67 22.23,4.76 33.66,4.76 35.56,2.86 B1.3.3V 39.37,6.35 55.88,6.35 58.42,8.89 v58.42,13.97
A0
  Bottom 0.305: B1.A0 53.75,5.49 56.24,5.49 59.28,8.53 59.28,14.33 58.78,14.83 58.06,14.83 57.56,14.33 57.56,9.25 55.52,7.21 50.52,7.21 47.98,9.75 37.24,9.75 31.75,15.24 26.67,15.24 24.13,12.7 21.54,12.7 17.5,16.74 15.01,16.74 J3.5
A1
  Bottom 0.305: J3.6 15.91,19.05 21.75,13.21 23.92,13.21 26.46,15.75 31.96,15.75 37.45,10.26 48.19,10.26 50.73,7.72 55.31,7.72 57.05,9.46 57.05,14.54 57.85,15.34 58.99,15.34 59.79,14.54 59.79,8.32 56.45,4.98 54.51,4.98 53.34,3.81 B1.A1
A2
  Bottom 0.305: B1.A2 55.88,3.69 60.3,8.11 60.3,14.75 59.2,15.85 57.64,15.85 56.54,14.75 56.54,9.67 55.1,8.23 50.94,8.23 48.4,10.77 37.66,10.77 32.17,16.26 26.25,16.26 23.71,13.72 21.96,13.72 17.78,17.9 J3.7
A3
  Bottom 0.305: B1.A3 58.42,5.51 60.81,7.9 60.81,14.96 59.41,16.36 57.43,16.36 56.03,14.96 56.03,9.88 54.89,8.74 51.15,8.74 48.61,11.28 37.87,11.28 32.38,16.76 21.34,16.76 20.32,17.78 J3.8
A4
  Bottom 0.305: J3.9 24.64,17.27 32.59,17.27 38.08,11.79 48.82,11.79 51.36,9.25 54.61,9.25 55.52,10.16 55.52,15.17 57.22,16.87 59.62,16.87 61.32,15.17 61.32,6.71 60.96,6.35 B1.A4
A5
  Bottom 0.305: J3.10 27.11,20.77 51.99,20.77 52.96,19.79 52.96,15.8 51.15,13.99 51.15,10.54 51.94,9.75 54.4,9.75 55.02,10.37 55.02,15.38 57.01,17.37 59.83,17.37 61.94,15.26 61.94,4.1 B1.A5
AREF
  Top 0.305: J2.4 14.15,45.9 19.23,45.9 23.88,50.55 B1.AREF
D0  (via drill 0.35 pad 0.65)
  Top 0.305: S2.2 55.35,36.76 55.35,38.69 56.03,39.37 v58.42,39.37
  Bottom 0.305: B1.D0 63.5,44.45 62.23,43.18 49.53,43.18 J2.19 50.8,39.37 v58.42,39.37
D1
  Top 0.305: S2.5 60.96,36.8 B1.D1
  Bottom 0.305: B1.D1 60.96,44.88 59.77,43.69 47.5,43.69 J2.18
D2  (via drill 0.35 pad 0.65)
  Top 0.254: Q1.1 48.36,33.97 R3.1 48.05,33.87 v46.99,34.92
  Bottom 0.254: v46.99,34.92 48.26,36.2 48.26,38.1 47.62,38.73 46.35,38.73 J2.17
  Bottom 0.305: B1.D2 58.42,45.72 56.9,44.2 45.47,44.2 J2.17
D3  (via drill 0.35 pad 0.65)
  Top 0.254: Q2.1 48.36,37.78 R4.1 48.16,37.78 v46.99,37.78
  Bottom 0.254: J2.16 44.77,37.78 v46.99,37.78
  Bottom 0.305: B1.D3 55.88,45.97 54.61,44.7 43.43,44.7 J2.16
D4  (via drill 0.35 pad 0.65)
  Top 0.254: Q3.1 40.74,33.97 R5.1 40.42,33.87 v39.37,34.92
  Bottom 0.254: v39.37,34.92 39.37,36.33 40.27,37.23 40.27,39.74 J2.15
  Bottom 0.305: B1.D4 53.34,46.48 52.07,45.21 41.4,45.21 J2.15
D5  (via drill 0.35 pad 0.65)
  Top 0.254: Q4.1 40.74,37.78 R6.1 40.54,37.78 v39.37,37.78
  Bottom 0.254: J2.14 39.37,38.1 v39.37,37.78
  Bottom 0.305: B1.D5 50.8,46.99 49.53,45.72 39.37,45.72 J2.14
D6  (via drill 0.35 pad 0.65)
  Top 0.254: Q5.1 33.12,33.97 R7.1 32.6,34.29 v31.75,34.29
  Bottom 0.254: v31.75,34.29 31.75,36.65 32.65,37.54 32.65,41.54 J2.13
  Bottom 0.305: B1.D6 48.26,47.5 46.99,46.23 37.34,46.23 J2.13
D7  (via drill 0.35 pad 0.65)
  Top 0.254: Q6.1 33.12,37.78 R8.1 32.17,37.68 v31.75,38.1
  Bottom 0.254: J2.12 31.75,40.64 v31.75,38.1
  Bottom 0.305: J2.12 35.31,46.74 44.83,46.74 45.72,47.62 B1.D7
D8  (via drill 0.35 pad 0.65)
  Top 0.254: Q7.1 25.5,33.97 R9.1 24.34,34.92 v24.13,34.92
  Bottom 0.254: J2.11 25.86,39.83 25.86,38.06 24.13,36.33 v24.13,34.92
  Bottom 0.305: B1.D8 41.66,48.26 40.64,47.24 33.27,47.24 J2.11
D9  (via drill 0.35 pad 0.65)
  Top 0.254: Q8.1 25.5,37.78 R10.1 24.34,37.68 v24.13,37.47
  Bottom 0.254: J2.10 25.4,38.73 v24.13,37.47
  Bottom 0.305: B1.D9 39.12,48.45 38.42,47.75 31.24,47.75 J2.10
D10  (via drill 0.35 pad 0.65)
  Top 0.254: R11.1 17.88,33.97 Q9.1 20.14,34.79 v20.14,34.92
  Bottom 0.254: v20.14,34.92 20.14,37.42 21.22,38.49 21.22,40.27 J2.9
  Bottom 0.305: B1.D10 36.58,48.96 35.88,48.26 29.21,48.26 J2.9
D11  (via drill 0.35 pad 0.65)
  Top 0.254: R12.1 17.88,37.78 Q10.1 19.36,37.78 v20.32,38.73
  Bottom 0.254: J2.8 v20.32,38.73
  Bottom 0.305: B1.D11 34.04,49.47 33.34,48.77 27.99,48.77 22.41,43.18 21.59,43.18 J2.8
D12  (via drill 0.35 pad 0.6)
  Top 0.254: R13.1 10.26,33.97 Q11.1 11.74,33.97 v12.7,34.92
  Bottom 0.254: J2.7 12.7,36.83 v12.7,34.92
  Bottom 0.305: B1.D12 29.97,49.28 27.78,49.28 22.32,43.81 19.68,43.81 J2.7
D13
  Top 0.254: R14.1 10.26,37.78 Q12.1 12.38,37.78 15.24,40.64 J2.6
  Bottom 0.305: B1.D13 27.94,49.78 27.57,49.78 22.11,44.32 18.15,44.32 15.74,41.91 J2.6
D20_SDA  (via drill 0.35 pad 0.65)
  Top 0.254: Q14.3 55.81,15.14
  Top 0.305: J2.3 12.7,46.99 17.53,46.99 B1.SDA | 55.81,15.14 R30.1 53.34,15.56 v54.29,16.51
  Bottom 0.305: B1.SDA 14.67,44.13 13.13,44.13 11.43,42.44 11.43,29.21 18.41,22.23 52.7,22.23 54.29,20.64 v54.29,16.51
D21_SCL  (via drill 0.35 pad 0.65)
  Top 0.254: Q13.3 53.73,11.26 R29.1
  Top 0.305: B1.SCL 18.8,50.16 16.64,48.01 10.76,48.01 5.08,42.33 J2.2 | v52.07,10.79 52.49,10.79 R29.1
  Bottom 0.305: B1.SCL 18.8,50.16 14.35,45.72 12.17,45.72 8.89,42.44 8.89,29.53 16.83,21.59 52.2,21.59 53.47,20.32 53.47,15.59 52.07,14.19 v52.07,10.79
ESPIO0
  Top 0.305: WIFI-BOOT.1 35.56,15.42 J3.14
ESPRX  (via drill 0.35 pad 0.65)
  Top 0.305: J3.18 44.45,20.32 v44.45,23.81 | v62.23,31.75 62.2,31.78 S2.4
  Bottom 0.305: v44.45,23.81 44.45,24.67 46.45,26.67 57.15,26.67 v62.23,31.75
ESPTX  (via drill 0.35 pad 0.65)
  Top 0.305: J3.17 v43.18,23.5 | v56.52,31.11 56.52,33.03 S2.1
  Bottom 0.305: v43.18,23.5 43.18,24.45 46.67,27.94 55.88,27.94 56.52,28.57 v56.52,31.11
GND  (via drill 0.35 pad 0.65)
  Top 0.254: 27.25,32.07 Q7.2
  Top 0.305: Q1.2 50.71,32.98 50.71,34.97 Q2.2 | Q4.2 42.18,35.22 43.09,34.3 43.09,32.98 Q3.2 | Q6.2 35.15,35.88 35.47,35.56 35.47,32.98 Q5.2 | Q7.2 27.85,32.98 27.85,34.97 Q8.2
  other vias: 16.51,34.92 26.35,34.92 29.21,34.92 62.87,11.43 49.21,34.92 41.59,34.92 34.29,6.99 63.18,8.57 52.07,16.83 55.88,20.32 33.97,34.92 13.97,34.92
  pour Top (isolate 0.406, rank 2): 0,0 68.58,0 68.58,55.88 0,55.88
  pour Bottom (isolate 0.406): 0,0 68.58,0 68.58,55.88 0,55.88
L2
  Top 0.254: Q1.3 52.75,32.17 R15.2
L3
  Top 0.254: Q2.3 52.75,35.98 R16.2
L4
  Top 0.254: Q3.3 45.13,32.17 R17.2
L5
  Top 0.254: Q4.3 45.13,35.98 R18.2
L6
  Top 0.254: Q5.3 37.51,32.17 R19.2
L7
  Top 0.254: Q6.3 37.51,35.98 R20.2
L8
  Top 0.254: Q7.3 29.89,32.17 R21.2
L9
  Top 0.254: Q8.3 29.89,35.98 R22.2
L10
  Top 0.254: Q9.3 22.27,32.17 R23.2
L11
  Top 0.254: Q10.3 22.27,35.98 R24.2
L12
  Top 0.254: Q11.3 14.65,32.17 R25.2
L13
  Top 0.254: R26.2 14.65,35.98 Q12.3
MEGARST  (via drill 0.35 pad 0.65)
  Top 0.305: v45.72,24.77 9.53,24.77 7.62,22.86 J3.3 7.62,18.41 8.89,17.14 30.8,17.14 32.44,15.51 32.44,9.58 26.04,3.17 26.04,1.91 26.99,0.95 31.75,0.95 33.02,2.22 B1.RESET@1
  Bottom 0.305: B1.RESET@2 46.3,25.35 v45.72,24.77
MISO  (via drill 0.35 pad 0.65)
  Top 0.305: J9.3 3.63,46.81 1.27,44.45 1.27,38.82 6.22,33.87 6.22,29.42 8.11,27.54 46.97,27.54 48.28,26.23 60.52,26.23 v60.96,26.67
  Bottom 0.305: v60.96,26.67 60.96,27.75 B1.MISO
MOSI
  Top 0.305: J9.4 2.63,47.31 0.67,45.35 0.67,38.7 5.71,33.66 5.71,29.21 7.89,27.03 46.76,27.03 48.39,25.4 60.96,25.4 62.18,26.62 64.91,26.62 B1.MOSI
N$1
  pour Top (isolate 0.61): 2.54,16.51 12.7,16.51 12.7,6.35 7.62,6.35 7.62,8.89 2.54,13.97
N$2
  Top 1.27: F1.P$2 D1.A
N$6
  Top 0.508: D14.C 65.09,19.91 64.67,20.32 R1.2
N$7
  Top 1.27: C2.1 21.61,5.08 VR1.OUT
  Bottom 0.813: S1.2 2.54,27.94 0.95,26.35 0.95,15.24 4.13,12.06 17.78,12.06 18.41,11.43 18.41,5.71 17.78,5.08 VR1.OUT
N$10
  Top 0.254: R26.1 16.37,37.68 18.09,39.4 22.89,39.4 24.13,40.64 24.13,42.65 30.11,48.63 30.25,48.77 30.25,51.8 D13.C
N$11
  Top 0.254: R25.1 16.07,33.04 16.07,31.52 17.11,30.48 19.05,30.48 20.72,32.15 20.72,37.34 22.37,38.99 25.02,38.99 26.72,40.69 26.72,42.7 32.65,48.63 32.79,48.77 32.79,51.8 D12.C
N$12
  Top 0.254: R24.1 23.66,38.48 26.67,38.48 29.21,41.02 29.21,42.65 35.19,48.63 35.33,48.77 35.33,51.8 D11.C
N$13
  Top 0.254: R23.1 22.86,33.58 23.61,32.83 23.61,31.31 24.45,30.48 27.94,30.48 28.34,30.88 28.34,38.29 30.16,40.11 41.27,40.11 41.91,40.74 41.91,44.22 37.87,48.26 37.87,51.8 D10.C
N$14
  Top 0.254: R22.1 30.48,38.95 31.18,39.65 43.46,39.65 44.45,40.64 44.45,44.06 40.45,48.06 40.41,48.1 40.41,51.8 D9.C
N$15
  Top 0.254: R21.1 30.48,33.58 31.23,32.83 31.23,31 31.75,30.48 34.61,30.48 35.96,31.83 35.96,37.34 37.81,39.19 44.14,39.19 45.35,40.4 46.21,40.4 46.99,41.17 46.99,45.4 43.81,48.58 43.81,50.94 D8.C
N$16
  Top 0.254: R20.1 39.16,38.73 44.33,38.73 45.54,39.94 48.3,39.94 49.53,41.17 49.53,45.77 46.99,48.31 46.99,52.07 45.96,53.1 D7.C
N$17
  Top 0.254: R19.1 38.1,33.58 38.85,32.83 38.85,31.63 40.01,30.48 42.86,30.48 43.58,31.19 43.58,37.34 45.64,39.4 50.83,39.4 52.07,40.64 52.07,45.72 49.53,48.26 49.53,51.83 D6.C
N$18
  Top 0.254: R18.1 46.98,38.94 51.02,38.94 52.53,40.45 52.53,47.18 52.07,47.64 52.07,51.83 D5.C
N$19
  Top 0.254: R17.1 45.72,33.58 46.47,32.83 46.47,31.63 47.62,30.48 50.48,30.48 51.2,31.19 51.2,38.47 52.98,40.26 52.98,45.36 54.61,46.99 54.61,51.83 D4.C
N$20
  Top 0.254: R16.1 53.34,39.02 53.76,39.44 53.76,44.87 57.15,48.26 57.15,51.83 D3.C
N$21
  Top 0.254: R15.1 54.61,35.14 54.61,44.45 59.69,49.53 59.69,52.07 58.66,53.1 D2.C
SCK
  Top 0.305: J9.2 4.63,45.72 3.81,44.9 3.81,37.47 6.99,34.29 6.99,29.53 8.26,28.26 47.31,28.26 47.94,27.62 63.37,27.62 B1.SCK
SCL_3V
  Top 0.305: J1.4 64.54,15.47 65.28,14.73 65.28,11.22 64.13,10.07 61.4,10.07 R27.1 60.22,8.15 59.69,7.62 57.73,7.62 56.83,8.53 Q13.2
SDA_3V
  Top 0.305: J1.3 62.37,14.47 61.59,15.24 61.59,16.51 60.64,17.46 R28.1 59.27,18.41 57.78,18.41 56.83,17.46 Q14.2
VCC
  Top 0.305: R30.2 52.6,12.7 50.8,12.7 | R29.2 51.33,9.95 50.8,10.48
  Top 0.508: D13.A D12.A D11.A D10.A D9.A D8.A D7.A D6.A D5.A D4.A D3.A D2.A 61.67,54.85 65.09,51.44 65.09,39.69 63.5,38.1 63.5,33.02 66.09,30.43 B1.VCC 67.94,28.66 67.94,23.59 D14.A 53.76,22 53.34,21.59
  Top 0.61: J3.20 53.34,21.59
  Top 1.016: B1.5V 38.1,3.81 | 38.1,3.81 40.64,6.35 43.18,6.35 47.31,10.48 50.16,10.48 | 50.8,11.43 50.8,12.7 J3.20 | 50.8,11.43 50.8,10.48 50.16,10.48 | 50.8,11.43 50.16,10.79 50.16,10.48 | B1.IOREF 30.48,3.81 31.75,5.08 36.83,5.08 38.1,3.81
  Top 1.27: S1.3 46.35,26.04 50.8,21.59 J3.20
VIN  (via drill 0.35 pad 0.65)
  Top 1.016: B1.VIN 45.72,6.99 v47.62,8.89
  Bottom 1.016: v47.62,8.89 30.48,8.89 27.94,11.43 27.94,13.95 C1.1
  pour Top (isolate 0.61): 15.88,16.19 13.65,13.97 13.65,8.89 19.05,8.89 22.23,12.06 28.26,12.06 29.21,13.02 29.21,14.61 27.62,16.19

### Text on the board
tPlace: SPI | NORM | External / Power | SPI | HYBR | OFF | USB Port / Towards Left | ON | Rev. A.1 | POWER
bPlace: Made on Earth by Humans | Revision A
tNames: J5 | J6 | VR1 | J7 | J8